# EAGLE design LEDMatrix_1_1 (EAGLE 4.16)
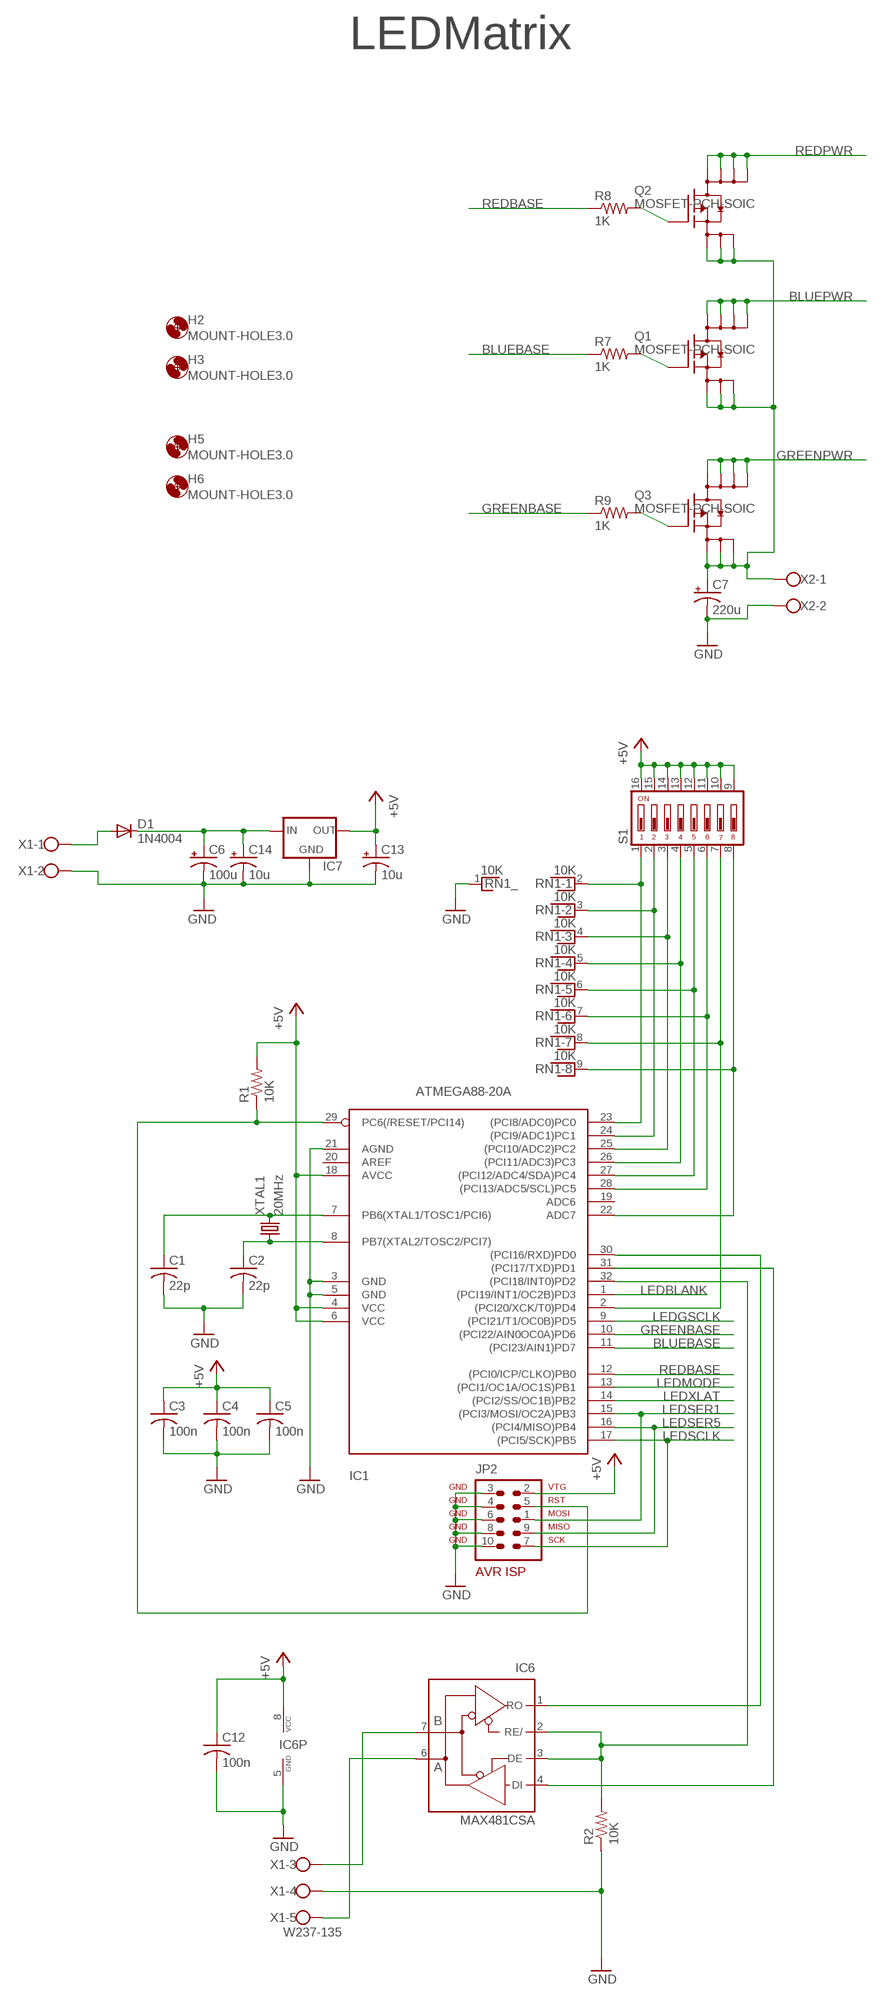
[diagram p0: schematic, sheet 1, part 1 of 2]
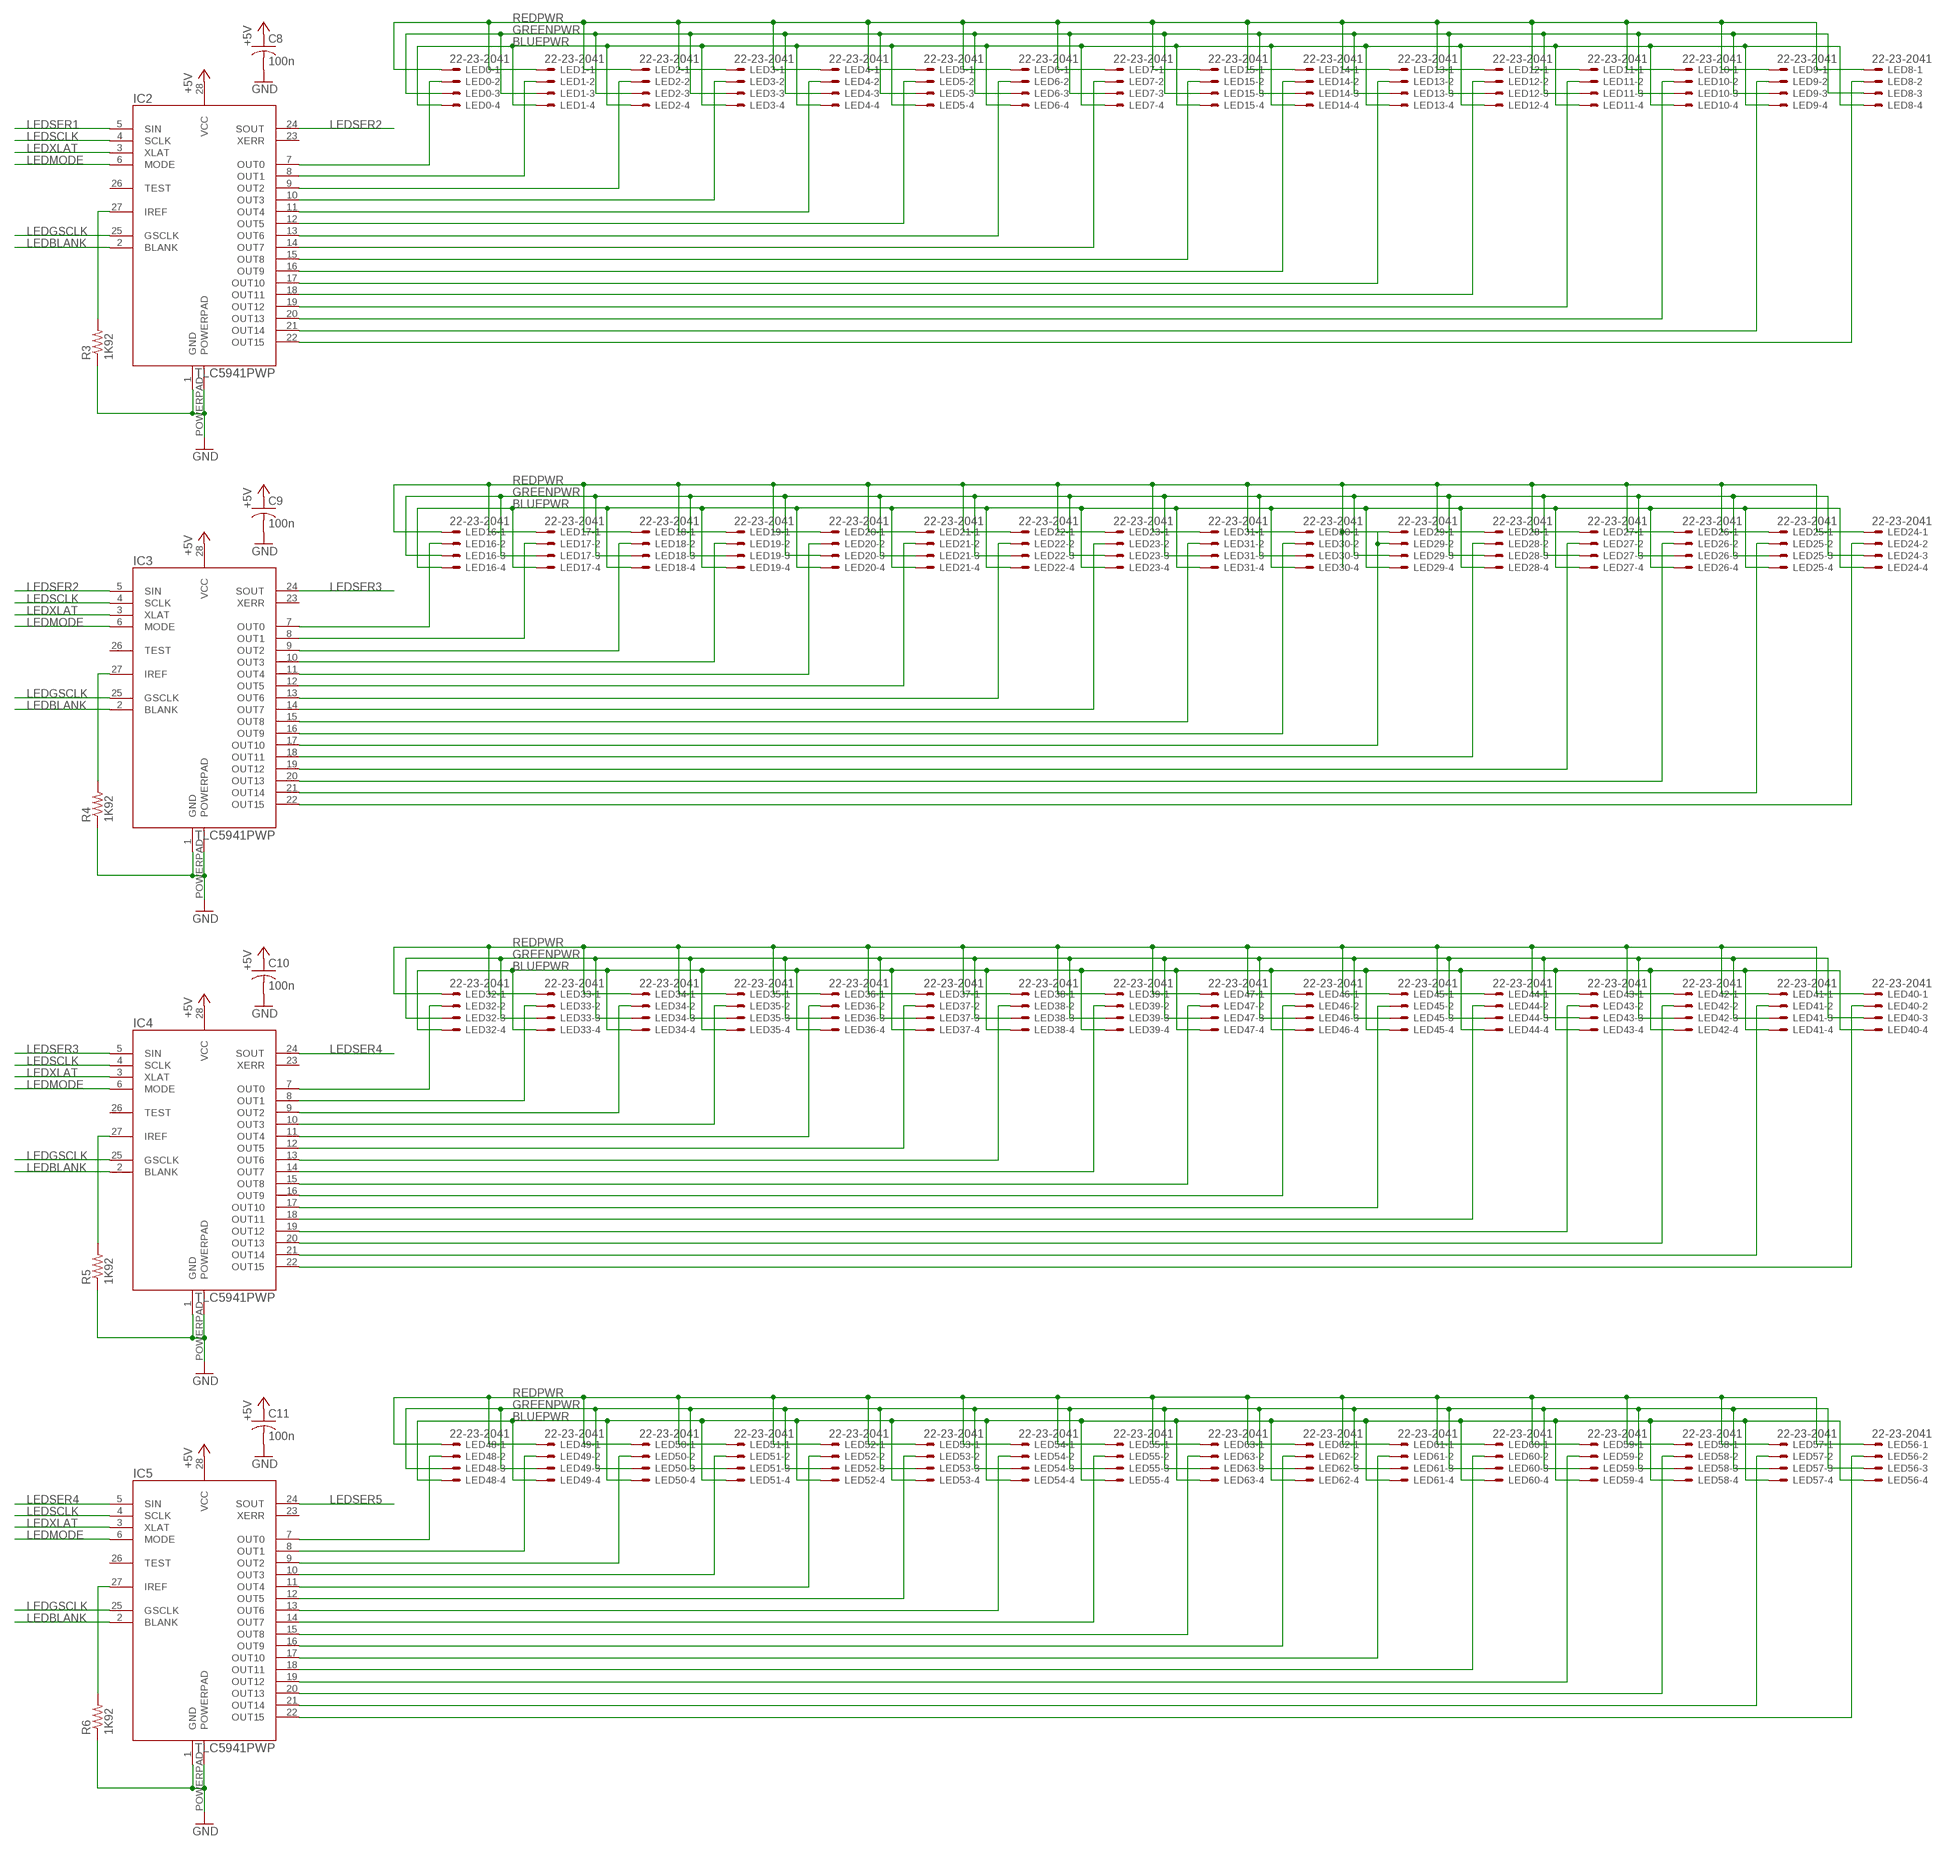
[diagram p1: schematic, sheet 1, part 2 of 2]

## Parts
C1  22p  C-USC0805  [C0805]
C2  22p  C-USC0805  [C0805]
C3  100n  C-USC0805  [C0805]
C4  100n  C-USC0805  [C0805]
C5  100n  C-USC0805  [C0805]
C6  100u  CPOL-USD  [PANASONIC_D]
C7  220u  CPOL-USE3.5-8  [E3,5-8]
C8  100n  C-USC0805  [C0805]
C9  100n  C-USC0805  [C0805]
C10  100n  C-USC0805  [C0805]
C11  100n  C-USC0805  [C0805]
C12  100n  C-USC0805  [C0805]
C13  10u  CPOL-USB  [PANASONIC_B]
C14  10u  CPOL-USB  [PANASONIC_B]
D1  1N4004  [DO41-10]
H2  MOUNT-HOLE3.0  [3,0]
H3  MOUNT-HOLE3.0  [3,0]
H5  MOUNT-HOLE3.0  [3,0]
H6  MOUNT-HOLE3.0  [3,0]
IC1  ATMEGA88-20A  ATMEGA48-20A  [TQFP32-08]
IC2  TLC5941PWP  [POWERPAD-28]
IC3  TLC5941PWP  [POWERPAD-28]
IC4  TLC5941PWP  [POWERPAD-28]
IC5  TLC5941PWP  [POWERPAD-28]
IC6  MAX481CSA  [SO08]
IC7  LM1117  [SOT223]
JP2  AVR-ISP-10ML  [ML10]
LED0  22-23-2041  [22-23-2041]
LED1  22-23-2041  [22-23-2041]
LED2  22-23-2041  [22-23-2041]
LED3  22-23-2041  [22-23-2041]
LED4  22-23-2041  [22-23-2041]
LED5  22-23-2041  [22-23-2041]
LED6  22-23-2041  [22-23-2041]
LED7  22-23-2041  [22-23-2041]
LED8  22-23-2041  [22-23-2041]
LED9  22-23-2041  [22-23-2041]
LED10  22-23-2041  [22-23-2041]
LED11  22-23-2041  [22-23-2041]
LED12  22-23-2041  [22-23-2041]
LED13  22-23-2041  [22-23-2041]
LED14  22-23-2041  [22-23-2041]
LED15  22-23-2041  [22-23-2041]
LED16  22-23-2041  [22-23-2041]
LED17  22-23-2041  [22-23-2041]
LED18  22-23-2041  [22-23-2041]
LED19  22-23-2041  [22-23-2041]
LED20  22-23-2041  [22-23-2041]
LED21  22-23-2041  [22-23-2041]
LED22  22-23-2041  [22-23-2041]
LED23  22-23-2041  [22-23-2041]
LED24  22-23-2041  [22-23-2041]
LED25  22-23-2041  [22-23-2041]
LED26  22-23-2041  [22-23-2041]
LED27  22-23-2041  [22-23-2041]
LED28  22-23-2041  [22-23-2041]
LED29  22-23-2041  [22-23-2041]
LED30  22-23-2041  [22-23-2041]
LED31  22-23-2041  [22-23-2041]
LED32  22-23-2041  [22-23-2041]
LED33  22-23-2041  [22-23-2041]
LED34  22-23-2041  [22-23-2041]
LED35  22-23-2041  [22-23-2041]
LED36  22-23-2041  [22-23-2041]
LED37  22-23-2041  [22-23-2041]
LED38  22-23-2041  [22-23-2041]
LED39  22-23-2041  [22-23-2041]
LED40  22-23-2041  [22-23-2041]
LED41  22-23-2041  [22-23-2041]
LED42  22-23-2041  [22-23-2041]
LED43  22-23-2041  [22-23-2041]
LED44  22-23-2041  [22-23-2041]
LED45  22-23-2041  [22-23-2041]
LED46  22-23-2041  [22-23-2041]
LED47  22-23-2041  [22-23-2041]
LED48  22-23-2041  [22-23-2041]
LED49  22-23-2041  [22-23-2041]
LED50  22-23-2041  [22-23-2041]
LED51  22-23-2041  [22-23-2041]
LED52  22-23-2041  [22-23-2041]
LED53  22-23-2041  [22-23-2041]
LED54  22-23-2041  [22-23-2041]
LED55  22-23-2041  [22-23-2041]
LED56  22-23-2041  [22-23-2041]
LED57  22-23-2041  [22-23-2041]
LED58  22-23-2041  [22-23-2041]
LED59  22-23-2041  [22-23-2041]
LED60  22-23-2041  [22-23-2041]
LED61  22-23-2041  [22-23-2041]
LED62  22-23-2041  [22-23-2041]
LED63  22-23-2041  [22-23-2041]
Q1  MOSFET-PCH-SOIC  [SOIC127P600X175-8AN]
Q2  MOSFET-PCH-SOIC  [SOIC127P600X175-8AN]
Q3  MOSFET-PCH-SOIC  [SOIC127P600X175-8AN]
R1  10K  R-US_M0805  [M0805]
R2  10K  R-US_M0805  [M0805]
R3  1K92  R-US_M0805  [M0805]
R4  1K92  R-US_M0805  [M0805]
R5  1K92  R-US_M0805  [M0805]
R6  1K92  R-US_M0805  [M0805]
R7  1K  R-US_M0805  [M0805]
R8  1K  R-US_M0805  [M0805]
R9  1K  R-US_M0805  [M0805]
RN1  10K  RNX9  [RN-10]
S1  DIP08YL  [DIP08YL]
X1  W237-135  [W237-135]
X2  W237-102  [W237-102]
XTAL1  20MHz  CRYSTALHC49S  [HC49/S]

## Nets
+5V: C3.1 C4.1 C5.1 C8.1 C9.1 C10.1 C11.1 C12.1 C13.+ IC1.4(VCC) IC1.6(VCC) IC1.18(AVCC) IC2.28(VCC) IC3.28(VCC) IC4.28(VCC) IC5.28(VCC) IC6.8(VCC) IC7.2(OUT) JP2.2 R1.2 S1.9 S1.10 S1.11 S1.12 S1.13 S1.14 S1.15 S1.16
BLUEBASE: IC1.11((PCI23/AIN1)PD7) R7.1
BLUEPWR: LED0.4 LED1.4 LED2.4 LED3.4 LED4.4 LED5.4 LED6.4 LED7.4 LED8.4 LED9.4 LED10.4 LED11.4 LED12.4 LED13.4 LED14.4 LED15.4 LED16.4 LED17.4 LED18.4 LED19.4 LED20.4 LED21.4 LED22.4 LED23.4 LED24.4 LED25.4 LED26.4 LED27.4 LED28.4 LED29.4 LED30.4 LED31.4 LED32.4 LED33.4 LED34.4 LED35.4 LED36.4 LED37.4 LED38.4 LED39.4 LED40.4 LED41.4 LED42.4 LED43.4 LED44.4 LED45.4 LED46.4 LED47.4 LED48.4 LED49.4 LED50.4 LED51.4 LED52.4 LED53.4 LED54.4 LED55.4 LED56.4 LED57.4 LED58.4 LED59.4 LED60.4 LED61.4 LED62.4 LED63.4 Q1.5(D) Q1.6(D1) Q1.7(D2) Q1.8(D3)
GND: C1.2 C2.2 C3.2 C4.2 C5.2 C6.- C7.- C8.2 C9.2 C10.2 C11.2 C12.2 C13.- C14.- IC1.3(GND) IC1.5(GND) IC1.21(AGND) IC2.1(GND) IC2.POWERPAD IC3.1(GND) IC3.POWERPAD IC4.1(GND) IC4.POWERPAD IC5.1(GND) IC5.POWERPAD IC6.5(GND) IC7.1(GND) JP2.3 JP2.4 JP2.6 JP2.8 JP2.10 R2.1 R3.1 R4.1 R5.1 R6.1 RN1.1 X1.2 X1.4 X2.2
GREENBASE: IC1.10((PCI22/AIN0OC0A)PD6) R9.1
GREENPWR: LED0.3 LED1.3 LED2.3 LED3.3 LED4.3 LED5.3 LED6.3 LED7.3 LED8.3 LED9.3 LED10.3 LED11.3 LED12.3 LED13.3 LED14.3 LED15.3 LED16.3 LED17.3 LED18.3 LED19.3 LED20.3 LED21.3 LED22.3 LED23.3 LED24.3 LED25.3 LED26.3 LED27.3 LED28.3 LED29.3 LED30.3 LED31.3 LED32.3 LED33.3 LED34.3 LED35.3 LED36.3 LED37.3 LED38.3 LED39.3 LED40.3 LED41.3 LED42.3 LED43.3 LED44.3 LED45.3 LED46.3 LED47.3 LED48.3 LED49.3 LED50.3 LED51.3 LED52.3 LED53.3 LED54.3 LED55.3 LED56.3 LED57.3 LED58.3 LED59.3 LED60.3 LED61.3 LED62.3 LED63.3 Q3.5(D) Q3.6(D1) Q3.7(D2) Q3.8(D3)
LEDBLANK: IC1.1((PCI19/INT1/OC2B)PD3) IC2.2(BLANK) IC3.2(BLANK) IC4.2(BLANK) IC5.2(BLANK)
LEDGSCLK: IC1.9((PCI21/T1/OC0B)PD5) IC2.25(GSCLK) IC3.25(GSCLK) IC4.25(GSCLK) IC5.25(GSCLK)
LEDMODE: IC1.13((PCI1/OC1A/OC1S)PB1) IC2.6(MODE) IC3.6(MODE) IC4.6(MODE) IC5.6(MODE)
LEDSCLK: IC1.17((PCI5/SCK)PB5) IC2.4(SCLK) IC3.4(SCLK) IC4.4(SCLK) IC5.4(SCLK) JP2.7
LEDSER1: IC1.15((PCI3/MOSI/OC2A)PB3) IC2.5(SIN) JP2.1
LEDSER2: IC2.24(SOUT) IC3.5(SIN)
LEDSER3: IC3.24(SOUT) IC4.5(SIN)
LEDSER4: IC4.24(SOUT) IC5.5(SIN)
LEDSER5: IC1.16((PCI4/MISO)PB4) IC5.24(SOUT) JP2.9
LEDXLAT: IC1.14((PCI2/SS/OC1B)PB2) IC2.3(XLAT) IC3.3(XLAT) IC4.3(XLAT) IC5.3(XLAT)
N$1: D1.A X1.1
N$2: C6.+ C14.+ D1.C IC7.3(IN)
N$33: IC2.7(OUT0) LED0.2
N$36: IC2.8(OUT1) LED1.2
N$37: IC2.9(OUT2) LED2.2
N$38: IC2.10(OUT3) LED3.2
N$39: IC2.11(OUT4) LED4.2
N$40: IC2.12(OUT5) LED5.2
N$41: IC2.13(OUT6) LED6.2
N$44: IC2.14(OUT7) LED7.2
N$45: IC2.15(OUT8) LED15.2
N$46: IC2.16(OUT9) LED14.2
N$47: IC2.17(OUT10) LED13.2
N$48: IC2.18(OUT11) LED12.2
N$49: IC2.19(OUT12) LED11.2
N$50: IC2.20(OUT13) LED10.2
N$51: IC2.21(OUT14) LED9.2
N$52: IC2.22(OUT15) LED8.2
N$89: IC3.7(OUT0) LED16.2
N$90: IC3.8(OUT1) LED17.2
N$91: IC3.9(OUT2) LED18.2
N$92: IC3.10(OUT3) LED19.2
N$93: IC3.11(OUT4) LED20.2
N$94: IC3.12(OUT5) LED21.2
N$95: IC3.13(OUT6) LED22.2
N$96: IC3.14(OUT7) LED23.2
N$97: IC3.15(OUT8) LED31.2
N$98: IC3.16(OUT9) LED30.2
N$99: IC3.17(OUT10) LED29.2
N$100: IC3.18(OUT11) LED28.2
N$101: IC3.19(OUT12) LED27.2
N$102: IC3.20(OUT13) LED26.2
N$103: IC3.21(OUT14) LED25.2
N$104: IC3.22(OUT15) LED24.2
N$141: IC4.7(OUT0) LED32.2
N$142: IC4.8(OUT1) LED33.2
N$143: IC4.9(OUT2) LED34.2
N$144: IC4.10(OUT3) LED35.2
N$145: IC4.11(OUT4) LED36.2
N$146: IC4.12(OUT5) LED37.2
N$147: IC4.13(OUT6) LED38.2
N$148: IC4.14(OUT7) LED39.2
N$149: IC4.15(OUT8) LED47.2
N$150: IC4.16(OUT9) LED46.2
N$151: IC4.17(OUT10) LED45.2
N$152: IC4.18(OUT11) LED44.2
N$153: IC4.19(OUT12) LED43.2
N$154: IC4.20(OUT13) LED42.2
N$155: IC4.21(OUT14) LED41.2
N$156: IC4.22(OUT15) LED40.2
N$193: IC5.7(OUT0) LED48.2
N$194: IC5.8(OUT1) LED49.2
N$195: IC5.9(OUT2) LED50.2
N$196: IC5.10(OUT3) LED51.2
N$197: IC5.11(OUT4) LED52.2
N$198: IC5.12(OUT5) LED53.2
N$199: IC5.13(OUT6) LED54.2
N$200: IC5.14(OUT7) LED55.2
N$201: IC5.15(OUT8) LED63.2
N$202: IC5.16(OUT9) LED62.2
N$203: IC5.17(OUT10) LED61.2
N$204: IC5.18(OUT11) LED60.2
N$205: IC5.19(OUT12) LED59.2
N$206: IC5.20(OUT13) LED58.2
N$207: IC5.21(OUT14) LED57.2
N$208: IC5.22(OUT15) LED56.2
N$211: C1.1 IC1.7(PB6(XTAL1/TOSC1/PCI6)) XTAL1.2
N$212: C2.1 IC1.8(PB7(XTAL2/TOSC2/PCI7)) XTAL1.1
N$213: IC1.23((PCI8/ADC0)PC0) RN1.2 S1.1
N$214: IC1.24((PCI9/ADC1)PC1) RN1.3 S1.2
N$215: IC1.25((PCI10/ADC2)PC2) RN1.4 S1.3
N$216: IC1.26((PCI11/ADC3)PC3) RN1.5 S1.4
N$217: IC1.27((PCI12/ADC4/SDA)PC4) RN1.6 S1.5
N$218: IC1.28((PCI13/ADC5/SCL)PC5) RN1.7 S1.6
N$219: IC1.2((PCI20/XCK/T0)PD4) RN1.8 S1.7
N$220: IC1.22(ADC7) RN1.9 S1.8
N$221: IC1.30((PCI16/RXD)PD0) IC6.1(RO)
N$222: IC1.31((PCI17/TXD)PD1) IC6.4(DI)
N$223: IC1.32((PCI18/INT0)PD2) IC6.2(RE/) IC6.3(DE) R2.2
N$224: C7.+ Q1.1(S) Q1.2(S1) Q1.3(S2) Q2.1(S) Q2.2(S1) Q2.3(S2) Q3.1(S) Q3.2(S1) Q3.3(S2) X2.1
N$225: IC1.29(PC6(/RESET/PCI14)) JP2.5 R1.1
N$229: IC6.7(B) X1.3
N$230: IC6.6(A) X1.5
N$232: Q2.4(G) R8.2
N$233: Q1.4(G) R7.2
N$234: Q3.4(G) R9.2
N$244: IC2.27(IREF) R3.2
N$245: IC3.27(IREF) R4.2
N$246: IC5.27(IREF) R6.2
N$247: IC4.27(IREF) R5.2
REDBASE: IC1.12((PCI0/ICP/CLKO)PB0) R8.1
REDPWR: LED0.1 LED1.1 LED2.1 LED3.1 LED4.1 LED5.1 LED6.1 LED7.1 LED8.1 LED9.1 LED10.1 LED11.1 LED12.1 LED13.1 LED14.1 LED15.1 LED16.1 LED17.1 LED18.1 LED19.1 LED20.1 LED21.1 LED22.1 LED23.1 LED24.1 LED25.1 LED26.1 LED27.1 LED28.1 LED29.1 LED30.1 LED31.1 LED32.1 LED33.1 LED34.1 LED35.1 LED36.1 LED37.1 LED38.1 LED39.1 LED40.1 LED41.1 LED42.1 LED43.1 LED44.1 LED45.1 LED46.1 LED47.1 LED48.1 LED49.1 LED50.1 LED51.1 LED52.1 LED53.1 LED54.1 LED55.1 LED56.1 LED57.1 LED58.1 LED59.1 LED60.1 LED61.1 LED62.1 LED63.1 Q2.5(D) Q2.6(D1) Q2.7(D2) Q2.8(D3)
Unconnected: IC1.19(ADC6) IC1.20(AREF) IC2.23(XERR) IC2.26(TEST) IC3.23(XERR) IC3.26(TEST) IC4.23(XERR) IC4.26(TEST) IC5.23(XERR) IC5.26(TEST) RN1.10

## Notes on the sheet
- LEDMatrix

## Library data of the parts
C1-C5 C8-C12 = rcl:C-US: CAPACITOR, American symbol
C6 C7 C13 C14 = rcl:CPOL-US: POLARIZED CAPACITOR, American symbol
D1 = diode:1N4004: DIODE general purpose rectifier, 1 A
H2 H3 H5 H6 = holes:MOUNT-HOLE: MOUNTING HOLE with drill center marker
IC1 = avr:ATMEGA48: MICROCONTROLLER 4 Kbytes FLASH 512 Bytes SRAM 256 Bytes EEPROM USART 8-channel 10 bit ADC
IC2-IC5 = rbg-ti-ledcontrol:TLC5941
IC6 = maxim:MAX481CSA: RS485 TRANSEIVER
IC7 = v-reg-3:LM1117
JP2 = atmel-1:AVR-ISP-10: AVR ISP-10 Serial Programming Header
LED0 LED1-LED63 = con-molex:22-23-2041: .100" (2.54mm) Center Header - 4 Pin
Q1-Q3 = ipc-7351-transistor:MOSFET-PCH-SOIC
R1-R9 = rcl:R-US_: RESISTOR, American symbol
RN1 = resistor-net:RNX9: RESISTOR NETWORK
S1 = switch-dil:DIP08YL: DIL/CODE SWITCH
X1 = rbg-generic-screwterm-5mm:W237-135
X2 = rbg-generic-screwterm-5mm:W237-102: WAGO SCREW CLAMP
XTAL1 = crystal:CRYSTAL: CRYSTAL

## Board
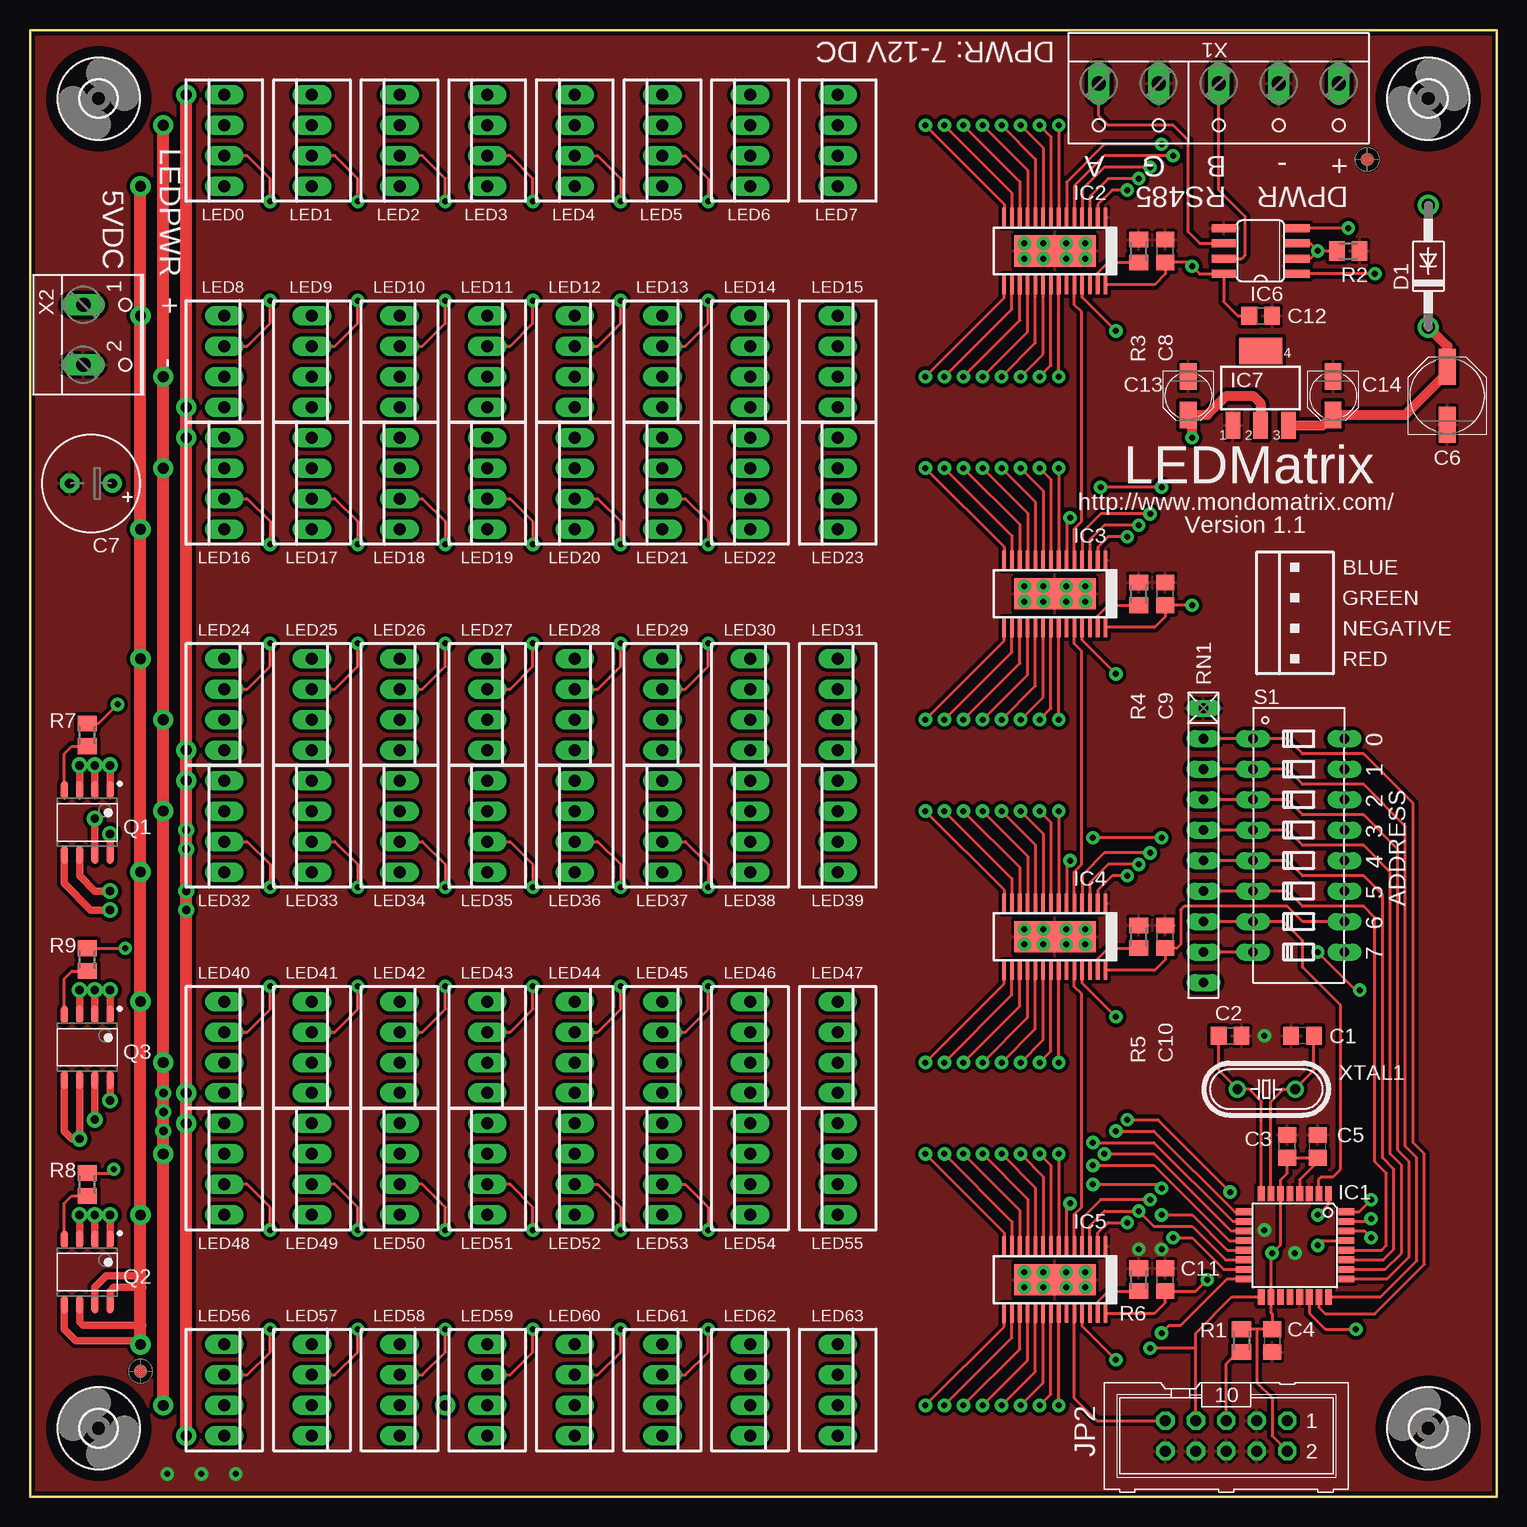
[diagram p2: board, top side]
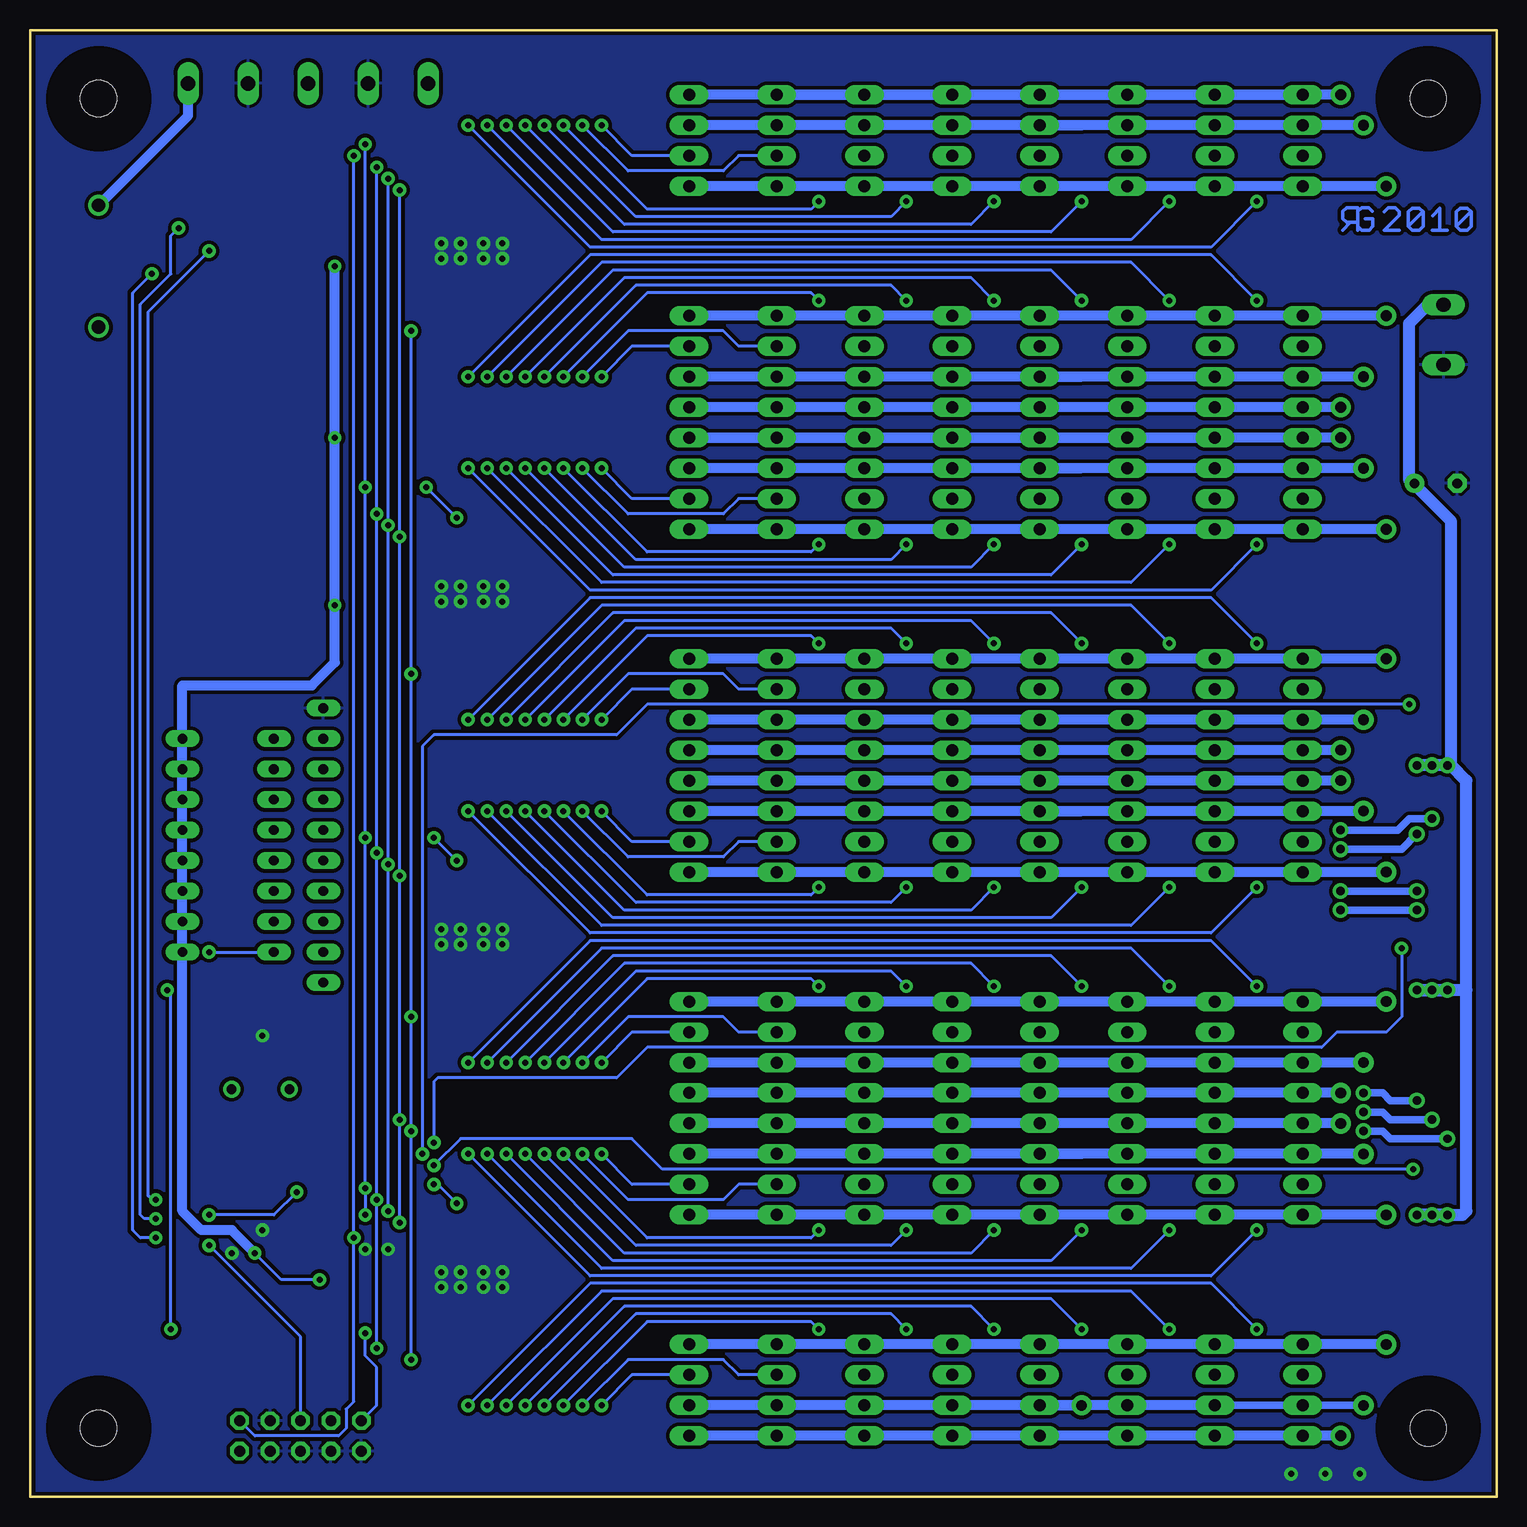
[diagram p3: board, bottom side, seen from below]

Size 122.24 x 122.24 mm. Coordinates in mm from the lower left corner, seen from the top.
Outline: 0,0 0,122.24 122.24,122.24 122.24,0 0,0
Copper layers (1*16): Top 0.035mm / dielectric 1.5mm / Bottom 0.035mm
Design rules "default": minimum track width 8mil, minimum drill 19mil, track to track 8mil, track to pad 8mil, pad to pad 8mil, via to via 8mil, smd to smd 8mil, copper to edge 10mil, drill to drill 8mil, minimum pad ring 12mil, minimum via ring 12mil, stop-mask expansion 4mil, vias tented up to drill 0mil, thermal gap 10mil

### Footprints (pad centres in the part's own frame; a part is rotated, then mirrored left to right if it is on the bottom)
C0805 = smd 1.3 x 1.5: 1 -0.95,0; 2 0.95,0
PANASONIC_D = smd 3 x 1.4: + 2.4,0; - -2.4,0
E3,5-8 = drill 0.813 pad 1.6 round: + -1.778,0 | drill 0.813 pad 1.6 octagon: - 1.778,0
PANASONIC_B = smd 2.2 x 1.4: + 1.6,0; - -1.6,0
DO41-10 = drill 1.118 round: A 5.08,0; C -5.08,0
3,0 = hole 3: 0,0
TQFP32-08 = smd 1.27 x 0.559: 1 -4.293,2.8; 2 -4.293,2; 3 -4.293,1.2; 4 -4.293,0.4; 5 -4.293,-0.4; 6 -4.293,-1.2; 7 -4.293,-2; 8 -4.293,-2.8; 17 4.293,-2.8; 18 4.293,-2; 19 4.293,-1.2; 20 4.293,-0.4; 21 4.293,0.4; 22 4.293,1.2; 23 4.293,2; 24 4.293,2.8 | smd 0.559 x 1.27: 9 -2.8,-4.293; 10 -2,-4.293; 11 -1.2,-4.293; 12 -0.4,-4.293; 13 0.4,-4.293; 14 1.2,-4.293; 15 2,-4.293; 16 2.8,-4.293; 25 2.8,4.293; 26 2,4.293; 27 1.2,4.293; 28 0.4,4.293; 29 -0.4,4.293; 30 -1.2,4.293; 31 -2,4.293; 32 -2.8,4.293
POWERPAD-28 = smd 0.3 x 1.6: 1 -4.225,-2.8; 2 -3.575,-2.8; 3 -2.925,-2.8; 4 -2.275,-2.8; 5 -1.625,-2.8; 6 -0.975,-2.8; 7 -0.325,-2.8; 8 0.325,-2.8; 9 0.975,-2.8; 10 1.625,-2.8; 11 2.275,-2.8; 12 2.925,-2.8; 13 3.575,-2.8; 14 4.225,-2.8; 15 4.225,2.8; 16 3.575,2.8; 17 2.925,2.8; 18 2.275,2.8; 19 1.625,2.8; 20 0.975,2.8; 21 0.325,2.8; 22 -0.325,2.8; 23 -0.975,2.8; 24 -1.625,2.8; 25 -2.275,2.8; 26 -2.925,2.8; 27 -3.575,2.8; 28 -4.225,2.8 | smd 6.8 x 2.6: POWERPAD 0,0
SO08 = smd 0.66 x 2.032: 1 -1.905,-3.073; 2 -0.635,-3.073; 3 0.635,-3.073; 4 1.905,-3.073; 5 1.905,3.073; 6 0.635,3.073; 7 -0.635,3.073; 8 -1.905,3.073
SOT223 = smd 1.219 x 2.235: 1 -2.311,-3.099; 2 0,-3.099; 3 2.311,-3.099 | smd 3.6 x 2.2: 4 0,3.099
ML10 = drill 0.914 octagon: 1 -5.08,-1.27; 2 -5.08,1.27; 3 -2.54,-1.27; 4 -2.54,1.27; 5 0,-1.27; 6 0,1.27; 7 2.54,-1.27; 8 2.54,1.27; 9 5.08,-1.27; 10 5.08,1.27
22-23-2041 = drill 1 long: 1 -3.81,0; 2 -1.27,0; 3 1.27,0; 4 3.81,0
SOIC127P600X175-8AN = smd 1.55 x 0.6: 1 -2.7,1.905; 2 -2.7,0.635; 3 -2.7,-0.635; 4 -2.7,-1.905; 5 2.7,-1.905; 6 2.7,-0.635; 7 2.7,0.635; 8 2.7,1.905
M0805 = smd 1.3 x 1.6: 1 -0.95,0; 2 0.95,0
RN-10 = drill 0.813 long: 1 -11.43,0; 2 -8.89,0; 3 -6.35,0; 4 -3.81,0; 5 -1.27,0; 6 1.27,0; 7 3.81,0; 8 6.35,0; 9 8.89,0; 10 11.43,0
DIP08YL = drill 0.813 long: 1 -8.89,-3.81; 2 -6.35,-3.81; 3 -3.81,-3.81; 4 -1.27,-3.81; 5 1.27,-3.81; 6 3.81,-3.81; 7 6.35,-3.81; 8 8.89,-3.81; 9 8.89,3.81; 10 6.35,3.81; 11 3.81,3.81; 12 1.27,3.81; 13 -1.27,3.81; 14 -3.81,3.81; 15 -6.35,3.81; 16 -8.89,3.81
W237-135 = drill 1.194 long: 1 -10,-1.27; 2 -5,-1.27; 3 0,-1.27; 4 5,-1.27; 5 10,-1.27
W237-102 = drill 1.194 long: 1 -2.5,-1.27; 2 2.5,-1.27
HC49/S = drill 0.813 round: 1 -2.413,0; 2 2.413,0

### Placement (x,y rotation side)
C1  106.05,38.42 180 top
C2  100.01,38.42 0 top
C3  104.78,29.21 90 top
C4  103.5,13.02 270 top
C5  107.31,29.21 90 top
C6  118.11,91.76 90 top
C7  5.08,84.45 180 top
C8  94.61,103.82 90 top
C9  94.61,75.25 90 top
C10  94.61,46.67 90 top
C11  94.61,18.1 90 top
C12  102.55,98.42 0 top
C13  96.52,91.76 270 top
C14  108.58,91.76 270 top
D1  116.52,102.55 90 top
H2  5.71,116.52 0 top
H3  116.52,116.52 0 top
H5  116.52,5.71 90 top
H6  5.71,5.71 90 top
IC1  105.41,20.95 270 top
IC2  85.41,103.82 180 top
IC3  85.41,75.25 180 top
IC4  85.41,46.67 180 top
IC5  85.41,18.1 180 top
IC6  102.55,103.82 90 top
IC7  102.55,92.39 0 top
JP2  99.69,5.08 180 top
LED0  16.19,113.03 90 top
LED1  23.5,113.03 90 top
LED2  30.8,113.03 90 top
LED3  38.1,113.03 90 top
LED4  45.4,113.03 90 top
LED5  52.7,113.03 90 top
LED6  60.01,113.03 90 top
LED7  67.31,113.03 90 top
LED8  16.19,94.61 270 top
LED9  23.5,94.61 270 top
LED10  30.8,94.61 270 top
LED11  38.1,94.61 270 top
LED12  45.4,94.61 270 top
LED13  52.7,94.61 270 top
LED14  60.01,94.61 270 top
LED15  67.31,94.61 270 top
LED16  16.19,84.45 90 top
LED17  23.5,84.45 90 top
LED18  30.8,84.45 90 top
LED19  38.1,84.45 90 top
LED20  45.4,84.45 90 top
LED21  52.7,84.45 90 top
LED22  60.01,84.45 90 top
LED23  67.31,84.45 90 top
LED24  16.19,66.04 270 top
LED25  23.5,66.04 270 top
LED26  30.8,66.04 270 top
LED27  38.1,66.04 270 top
LED28  45.4,66.04 270 top
LED29  52.7,66.04 270 top
LED30  60.01,66.04 270 top
LED31  67.31,66.04 270 top
LED32  16.19,55.88 90 top
LED33  23.5,55.88 90 top
LED34  30.8,55.88 90 top
LED35  38.1,55.88 90 top
LED36  45.4,55.88 90 top
LED37  52.7,55.88 90 top
LED38  60.01,55.88 90 top
LED39  67.31,55.88 90 top
LED40  16.19,37.47 270 top
LED41  23.5,37.47 270 top
LED42  30.8,37.47 270 top
LED43  38.1,37.47 270 top
LED44  45.4,37.47 270 top
LED45  52.7,37.47 270 top
LED46  60.01,37.47 270 top
LED47  67.31,37.47 270 top
LED48  16.19,27.3 90 top
LED49  23.5,27.3 90 top
LED50  30.8,27.3 90 top
LED51  38.1,27.3 90 top
LED52  45.4,27.3 90 top
LED53  52.7,27.3 90 top
LED54  60.01,27.3 90 top
LED55  67.31,27.3 90 top
LED56  16.19,8.89 270 top
LED57  23.5,8.89 270 top
LED58  30.8,8.89 270 top
LED59  38.1,8.89 270 top
LED60  45.4,8.89 270 top
LED61  52.7,8.89 270 top
LED62  60.01,8.89 270 top
LED63  67.31,8.89 270 top
Q1  4.76,56.2 270 top
Q2  4.76,18.73 270 top
Q3  4.76,37.47 270 top
R1  100.97,13.02 90 top
R2  109.86,103.82 180 top
R3  92.39,103.82 270 top
R4  92.39,75.25 270 top
R5  92.39,46.67 270 top
R6  92.39,18.1 270 top
R7  4.76,63.5 270 top
R8  4.76,26.04 270 top
R9  4.76,44.77 270 top
RN1  97.79,54.29 270 top
S1  105.73,54.29 270 top
U$1  [RGLOGO_SMALL_2010]  11.43,105.41 0 bottom
U$2  [LED-LEGEND]  102.87,68.58 0 top
U$3  [FIDUCIAL_G10]  9.21,10.48 0 top
U$4  [FIDUCIAL_G10]  111.44,111.44 180 top
X1  99.06,116.52 180 top
X2  5.71,96.84 270 top
XTAL1  103.03,33.97 0 top

### Tracks (layer width: path | path; a pad name or v marks a point on that pad's centre or on a via)
+5V  (via drill 0.5)
  Top 0.254: IC2.28 93.72,101.02 94.61,101.92 C8.1 96.52,102.87 v96.84,102.55 97.47,101.92 IC6.8 99.48,99.59 100.65,98.42 C12.1 | IC3.28 93.72,72.45 94.61,73.34 C9.1 v96.83,74.3 v96.84,74.3 | IC4.28 93.72,43.87 94.61,44.77 C10.1 95.57,45.72 95.89,46.04 95.89,48.9 96.2,49.21 104.78,49.21 106.05,47.94 S1.10 | IC5.28 93.72,15.3 94.61,16.19 C11.1 97.16,17.15 v98.11,18.1 | R1.2 102.23,13.97 | 102.23,13.97 C4.1 103.5,15.24 103.41,15.34 IC1.18 103.41,20.23 v103.5,20.32 104.21,21.02 104.21,21.27 IC1.6 104.21,26.42 104.78,26.99 C3.1 | JP2.2 103.5,5.08 103.5,8.26 102.23,9.53 102.23,13.97 | 102.23,13.97 | C5.1 107.31,27.94 105.81,26.43 IC1.4 | C3.1 | C5.1 | C3.1 C5.1
  Top 0.813: C13.+ 96.84,89.85 v96.84,88.27 | IC7.2 102.55,91.12 101.92,91.76 99.69,91.76 98.11,90.17 C13.+ | C13.+
  Bottom 0.254: v98.11,18.1 101.28,18.1 v103.5,20.32
  Bottom 0.813: v103.5,20.32 105.41,22.23 107.95,22.23 109.54,23.81 S1.9 S1.10 S1.11 S1.12 S1.13 S1.14 S1.15 S1.16 109.54,67.63 98.74,67.63 96.84,69.53 v96.84,74.3 v96.84,88.27 v96.84,102.55
BLUEBASE  (via drill 0.5)
  Top 0.254: R7.1 5.71,64.45 v7.3,66.04 | v89.53,28.57 93.66,28.57 100.08,22.16 IC1.11
  Bottom 0.254: v7.3,66.04 70.8,66.04 73.34,63.5 88.58,63.5 89.53,62.55 v89.53,28.57
BLUEPWR  (via drill 0.7 pad 1.27, 0.9 pad 1.68)
  Top 0.61: v6.67,55.24 Q1.8 | v5.4,56.52 Q1.7 | Q1.6 4.13,51.75 5.4,50.48 v6.67,50.48 | Q1.5 2.86,51.12 5.08,48.9 v6.67,48.9
  Top 1.016: v13.02,5.08 v13.02,31.11 v13.02,33.66 v13.02,48.9 v13.02,50.48 v13.02,53.98 v13.02,55.56 v13.02,59.69 v13.02,62.23 v13.02,88.27 v13.02,90.81 v13.02,116.84
  Bottom 0.61: v13.02,53.98 7.94,53.98 v6.67,55.24 | v5.4,56.52 7.3,56.52 8.26,55.56 v13.02,55.56 | v13.02,50.48 v6.67,50.48 | v13.02,48.9 v6.67,48.9
  Bottom 0.813: LED6.4 LED7.4 | LED6.4 LED5.4 LED4.4 LED3.4 LED2.4 LED1.4 LED0.4 | LED15.4 60.64,90.81 60.33,91.12 LED14.4 LED13.4 LED12.4 LED11.4 LED10.4 LED9.4 LED8.4 v13.02,90.81 | LED17.4 LED18.4 LED19.4 LED20.4 LED21.4 LED22.4 LED23.4 LED16.4 v13.02,88.27 | v13.02,116.84 LED6.4 | v13.02,5.08 LED56.4 LED57.4 LED58.4 LED59.4 LED60.4 LED61.4 LED62.4 LED63.4 | v13.02,31.11 LED48.4 LED49.4 LED50.4 LED51.4 LED52.4 LED53.4 LED54.4 LED55.4 | v13.02,33.66 LED40.4 LED41.4 LED42.4 LED43.4 LED44.4 LED45.4 LED46.4 LED47.4 | v13.02,59.69 LED32.4 LED33.4 LED34.4 LED35.4 LED36.4 LED37.4 LED38.4 LED39.4 | v13.02,62.23 LED24.4 LED25.4 LED26.4 LED27.4 LED28.4 LED29.4 LED30.4 LED31.4
GND  (via drill 0.5)
  other vias: 102.87,22.23 105.41,20.32 102.87,38.42 92.39,20.64 94.3,20.64 82.87,18.73 84.45,18.73 82.87,17.46 84.45,17.46 86.36,17.46 86.36,18.73 87.95,18.73 87.95,17.46 82.87,47.31 82.87,46.04 84.45,46.04 84.45,47.31 86.36,47.31 86.36,46.04 87.95,46.04 87.95,47.31 87.95,75.88 87.95,74.61 86.36,74.61 86.36,75.88 84.45,75.88 84.45,74.61 82.87,74.61 82.87,75.88 82.87,104.46 82.87,103.19 84.45,103.19 84.45,104.46 86.36,104.46 86.36,103.19 87.95,103.19 87.95,104.46 11.43,1.91 14.29,1.91 17.14,1.91
  pour Top (isolate 0.305): -1.59,123.83 124.78,123.83 124.78,-0.95 -1.59,-0.95
  pour Bottom (isolate 0.305): -1.59,123.83 124.78,123.83 124.78,-0.95 -1.59,-0.95
GREENBASE  (via drill 0.5)
  Top 0.254: R9.1 v7.93,45.72 v7.94,45.72 | v88.58,29.53 93.66,29.53 100.23,22.95 IC1.10
  Bottom 0.254: v88.58,29.53 88.58,34.61 88.27,34.92 73.34,34.92 70.8,37.47 14.61,37.47 13.34,38.73 9.21,38.73 7.94,40.01 v7.94,45.72
GREENPWR  (via drill 0.7 pad 1.27, 0.9 pad 1.68)
  Top 0.61: v6.67,33.02 Q3.8 | v5.4,31.43 Q3.7 | Q3.6 v4.13,29.84 3.49,29.84 2.86,30.48 Q3.5
  Top 1.016: v11.11,7.62 v11.11,28.57 v11.11,30.48 v11.11,32.07 v11.11,33.66 v11.11,36.2 v11.11,57.15 v11.11,64.77 v11.11,85.72 v11.11,93.34 v11.11,114.3
  Bottom 0.61: v11.11,7.62 LED56.3 LED57.3 | v11.11,33.66 9.53,33.66 8.89,33.02 v6.67,33.02 | v11.11,32.07 9.53,32.07 8.89,31.43 v5.4,31.43 | v4.13,29.84 8.89,29.84 9.53,30.48 v11.11,30.48
  Bottom 0.813: LED57.3 LED58.3 LED59.3 v34.61,7.62 LED60.3 LED61.3 | LED61.3 53.02,7.62 | LED61.3 LED62.3 LED63.3 | LED55.3 LED54.3 LED53.3 LED52.3 LED51.3 | LED51.3 37.78,28.57 | LED51.3 34.61,28.57 | LED51.3 LED50.3 LED49.3 LED48.3 v11.11,28.57 | LED47.3 LED46.3 LED45.3 LED44.3 LED43.3 LED42.3 LED41.3 LED40.3 v11.11,36.2 | LED38.3 59.69,57.15 | LED38.3 LED39.3 | LED38.3 LED37.3 LED36.3 LED35.3 | LED35.3 34.61,57.15 | LED35.3 LED34.3 LED33.3 LED32.3 v11.11,57.15 | LED31.3 LED30.3 LED29.3 LED28.3 LED27.3 LED26.3 LED25.3 LED24.3 v11.11,64.77 | LED19.3 34.61,85.72 | LED19.3 LED18.3 LED17.3 LED16.3 v11.11,85.72 | LED15.3 LED14.3 LED13.3 LED12.3 LED11.3 | LED11.3 34.61,93.34 | LED11.3 LED10.3 LED9.3 LED8.3 v11.11,93.34 | LED7.3 LED6.3 LED5.3 | LED5.3 52.39,114.3 | LED5.3 LED4.3 LED3.3 | LED3.3 34.61,114.3 | LED3.3 LED2.3 LED1.3 LED0.3 v11.11,114.3 | LED19.3 LED20.3 LED21.3 LED22.3 LED23.3
LEDBLANK  (via drill 0.5)
  Top 0.254: IC2.2 88.98,107.72 90.17,108.9 v91.44,108.9 | IC5.2 88.98,21.99 89.85,22.86 v91.44,22.86 | IC4.2 88.98,50.56 90.17,51.75 v91.44,51.75 | IC3.2 88.98,79.14 89.85,80.01 v91.44,80.01 | IC1.1 108.21,24.39 v107.31,23.5 | v91.44,31.43 93.98,31.43 v100.01,25.4
  Bottom 0.254: v91.44,22.86 v91.44,31.43 v91.44,51.75 v91.44,80.01 v91.44,108.9 | v107.31,23.5 101.92,23.5 v100.01,25.4
LEDGSCLK  (via drill 0.5)
  Top 0.254: IC2.25 87.68,99.96 v90.49,97.16 | IC5.25 87.68,14.23 v90.49,11.43 | IC4.25 87.68,42.81 v90.49,40.01 | IC3.25 87.68,71.39 v90.49,68.58 | IC1.9 100.39,23.75 93.66,30.48 v90.49,30.48
  Bottom 0.254: v90.49,11.43 v90.49,30.48 v90.49,40.01 v90.49,68.58 v90.49,97.16
LEDMODE  (via drill 0.5)
  Top 0.254: IC2.6 86.38,109.56 89.53,112.71 v94.3,112.71 | v88.58,26.04 93.98,26.04 v94.3,25.72 | IC5.6 86.38,24.15 v86.68,24.45 | 86.38,81.28 IC3.6 | 86.38,81.28 86.38,81.3 | v94.3,84.14 v89.22,84.14 | IC4.6 86.38,52.73 v86.68,53.02 | v94.3,54.93 v88.58,54.93 | 86.38,81.28 86.36,81.28 v86.68,81.6 | IC1.13 99.78,20.55 96.84,23.5 v94.3,23.5
  Bottom 0.254: v94.3,112.71 v94.3,84.14 v94.3,54.93 v94.3,25.72 v94.3,23.5 | v86.68,24.45 88.27,26.04 v88.58,26.04 | v88.58,54.93 v86.68,53.02 | v89.22,84.14 v86.68,81.6
LEDSCLK  (via drill 0.5)
  Top 0.254: IC5.4 87.68,23.23 89.22,24.77 v93.34,24.77 | IC2.4 87.68,108.95 89.53,110.81 v93.34,110.81 | IC3.4 87.68,80.38 89.22,81.92 v93.34,81.92 | IC4.4 87.68,51.8 89.53,53.66 v93.34,53.66 | IC1.17 100.17,16.66 97.16,13.65 97.16,12.38 | JP2.7 97.16,12.38 | 97.16,12.38 v93.34,12.38
  Bottom 0.254: v93.34,110.81 v93.34,81.92 v93.34,53.66 v93.34,24.77 v93.34,12.38
LEDSER1  (via drill 0.5)
  Top 0.254: IC2.5 87.03,109.26 89.53,111.76 v95.25,111.76 | IC1.15 99.47,18.95 96.84,21.59 v95.25,21.59
  Bottom 0.254: v95.25,111.76 v95.25,21.59 95.25,7.94 95.89,7.3 95.89,5.71 96.52,5.08 103.5,5.08 JP2.1
LEDSER2
  Top 0.254: IC3.5 87.03,80.68 87.63,81.28 87.63,98.74 87.03,99.34 IC2.24
LEDSER3
  Top 0.254: IC4.5 87.03,52.11 87.63,52.7 87.63,70.48 87.03,71.08 IC3.24
LEDSER4
  Top 0.254: IC5.5 87.03,23.53 87.63,24.13 87.63,41.91 87.03,42.51 IC4.24
LEDSER5  (via drill 0.5)
  Top 0.254: IC5.24 87.03,8.22 88.9,6.35 JP2.9 | IC1.16 99.75,18.16 95.89,14.29 94.93,14.29 v94.3,13.65
  Bottom 0.254: v94.3,13.65 94.3,11.75 93.34,10.79 93.34,7.62 JP2.9
LEDXLAT  (via drill 0.5)
  Top 0.254: IC2.3 88.33,108.33 89.85,109.86 v92.39,109.86 | IC5.3 88.33,22.61 89.53,23.81 v92.39,23.81 93.66,22.54 96.84,22.54 99.62,19.75 IC1.14 | IC3.3 88.33,79.76 89.53,80.96 v92.39,80.96 | IC4.3 88.33,51.19 89.85,52.7 v92.39,52.7
  Bottom 0.254: v92.39,23.81 v92.39,52.7 v92.39,80.96 v92.39,109.86
N$1
  Bottom 0.813: X1.1 109.06,115.09 D1.A
N$2
  Top 0.813: D1.C 118.11,95.89 C6.+ 118.11,93.66 114.61,90.16 C14.+ 107.71,89.29 IC7.3
N$33  (via drill 0.5)
  Top 0.254: IC2.7 85.73,114.29 v85.72,114.3 | LED0.2 18.1,111.76 20,109.86 v20,107.95
  Bottom 0.254: v85.72,114.3 75.56,104.14 23.81,104.14 v20,107.95
N$36  (via drill 0.5)
  Top 0.254: IC2.8 85.08,113.36 v84.14,114.3 | LED1.2 25.4,111.76 27.3,109.86 v27.3,107.95
  Bottom 0.254: v84.14,114.3 74.61,104.78 30.48,104.78 v27.3,107.95
N$37  (via drill 0.5)
  Top 0.254: IC2.9 84.43,112.42 v82.55,114.3 | LED2.2 32.7,111.76 34.61,109.86 v34.61,107.95
  Bottom 0.254: v82.55,114.3 73.66,105.41 37.15,105.41 v34.61,107.95
N$38  (via drill 0.5)
  Top 0.254: IC2.10 83.78,111.48 v80.96,114.3 | LED3.2 40.01,111.76 41.91,109.86 v41.91,107.95
  Bottom 0.254: v80.96,114.3 72.71,106.05 43.81,106.05 v41.91,107.95
N$39  (via drill 0.5)
  Top 0.254: IC2.11 83.13,110.54 v79.38,114.3 | LED4.2 47.31,111.76 49.21,109.86 v49.21,107.95
  Bottom 0.254: v79.38,114.3 71.75,106.68 50.48,106.68 v49.21,107.95
N$40  (via drill 0.5)
  Top 0.254: IC2.12 82.48,109.61 v77.79,114.3 | LED5.2 54.61,111.76 56.52,109.86 v56.52,107.95
  Bottom 0.254: v77.79,114.3 70.8,107.31 57.15,107.31 v56.52,107.95
N$41  (via drill 0.5)
  Top 0.254: IC2.13 81.83,108.67 v76.2,114.3
  Bottom 0.254: v76.2,114.3 72.39,110.49 64.45,110.49 63.18,111.76 LED6.2
N$44  (via drill 0.5)
  Top 0.254: IC2.14 81.18,107.73 v74.61,114.3
  Bottom 0.254: v74.61,114.3 72.07,111.76 LED7.2
N$45  (via drill 0.5)
  Top 0.254: IC2.15 81.18,99.92 v74.61,93.34
  Bottom 0.254: v74.61,93.34 72.07,95.89 LED15.2
N$46  (via drill 0.5)
  Top 0.254: IC2.16 81.83,98.98 v76.2,93.34
  Bottom 0.254: v76.2,93.34 72.39,97.16 64.45,97.16 63.18,95.89 LED14.2
N$47  (via drill 0.5)
  Top 0.254: IC2.17 82.48,98.04 v77.79,93.34 | LED13.2 54.61,95.89 56.52,97.79 v56.52,99.69
  Bottom 0.254: v77.79,93.34 70.8,100.33 57.15,100.33 v56.52,99.69
N$48  (via drill 0.5)
  Top 0.254: IC2.18 83.13,97.1 v79.38,93.34 | LED12.2 47.31,95.89 49.21,97.79 v49.21,99.69
  Bottom 0.254: v79.38,93.34 71.75,100.97 50.48,100.97 v49.21,99.69
N$49  (via drill 0.5)
  Top 0.254: IC2.19 83.78,96.17 v80.96,93.34 | LED11.2 40.01,95.89 41.91,97.79 v41.91,99.69
  Bottom 0.254: v80.96,93.34 72.71,101.6 43.81,101.6 v41.91,99.69
N$50  (via drill 0.5)
  Top 0.254: IC2.20 84.43,95.23 v82.55,93.34 | LED10.2 32.7,95.89 34.61,97.79 v34.61,99.69
  Bottom 0.254: v82.55,93.34 73.66,102.23 37.15,102.23 v34.61,99.69
N$51  (via drill 0.5)
  Top 0.254: IC2.21 85.08,94.29 v84.14,93.34 | LED9.2 25.4,95.89 27.3,97.79 v27.3,99.69
  Bottom 0.254: v84.14,93.34 74.61,102.87 30.48,102.87 v27.3,99.69
N$52  (via drill 0.5)
  Top 0.254: IC2.22 85.73,93.35 v85.72,93.34 | LED8.2 18.1,95.89 20,97.79 v20,99.69
  Bottom 0.254: v85.72,93.34 75.56,103.5 23.81,103.5 v20,99.69
N$89  (via drill 0.5)
  Top 0.254: IC3.7 85.73,85.72 v85.72,85.72 | LED16.2 18.1,83.19 20,81.28 v20,79.38
  Bottom 0.254: v85.72,85.72 75.56,75.56 23.81,75.56 v20,79.38
N$90  (via drill 0.5)
  Top 0.254: IC3.8 85.08,84.78 v84.14,85.72 | LED17.2 25.4,83.19 27.3,81.28 v27.3,79.38
  Bottom 0.254: v84.14,85.72 74.61,76.2 30.48,76.2 v27.3,79.38
N$91  (via drill 0.5)
  Top 0.254: IC3.9 84.43,83.84 v82.55,85.72 | LED18.2 32.7,83.19 34.61,81.28 v34.61,79.38
  Bottom 0.254: v82.55,85.72 73.66,76.83 37.15,76.83 v34.61,79.38
N$92  (via drill 0.5)
  Top 0.254: IC3.10 83.78,82.91 v80.96,85.72 | LED19.2 40.01,83.19 41.91,81.28 v41.91,79.38
  Bottom 0.254: v80.96,85.72 72.71,77.47 43.81,77.47 v41.91,79.38
N$93  (via drill 0.5)
  Top 0.254: IC3.11 83.13,81.97 v79.38,85.72 | LED20.2 47.31,83.19 49.21,81.28 v49.21,79.38
  Bottom 0.254: v79.38,85.72 71.75,78.11 50.48,78.11 v49.21,79.38
N$94  (via drill 0.5)
  Top 0.254: IC3.12 82.48,81.03 v77.79,85.72 | LED21.2 54.61,83.19 56.52,81.28 v56.52,79.38
  Bottom 0.254: v77.79,85.72 70.8,78.74 57.15,78.74 v56.52,79.38
N$95  (via drill 0.5)
  Top 0.254: IC3.13 81.83,80.09 v76.2,85.72
  Bottom 0.254: v76.2,85.72 72.39,81.92 64.45,81.92 63.18,83.19 LED22.2
N$96  (via drill 0.5)
  Top 0.254: IC3.14 81.18,79.16 v74.61,85.72
  Bottom 0.254: v74.61,85.72 72.07,83.19 LED23.2
N$97  (via drill 0.5)
  Top 0.254: IC3.15 81.18,71.34 v74.61,64.77
  Bottom 0.254: v74.61,64.77 72.07,67.31 LED31.2
N$98  (via drill 0.5)
  Top 0.254: IC3.16 81.83,70.4 v76.2,64.77
  Bottom 0.254: v76.2,64.77 72.39,68.58 64.45,68.58 63.18,67.31 LED30.2
N$99  (via drill 0.5)
  Top 0.254: IC3.17 82.48,69.47 v77.79,64.77 | LED29.2 54.61,67.31 56.52,69.22 v56.52,71.12
  Bottom 0.254: v77.79,64.77 70.8,71.75 57.15,71.75 v56.52,71.12
N$100  (via drill 0.5)
  Top 0.254: IC3.18 83.13,68.53 v79.38,64.77 | LED28.2 47.31,67.31 49.21,69.22 v49.21,71.12
  Bottom 0.254: v79.38,64.77 71.75,72.39 50.48,72.39 v49.21,71.12
N$101  (via drill 0.5)
  Top 0.254: IC3.19 83.78,67.59 v80.96,64.77 | LED27.2 40.01,67.31 41.91,69.22 v41.91,71.12
  Bottom 0.254: v80.96,64.77 72.71,73.03 43.81,73.03 v41.91,71.12
N$102  (via drill 0.5)
  Top 0.254: IC3.20 84.43,66.65 v82.55,64.77 | LED26.2 32.7,67.31 34.61,69.22 v34.61,71.12
  Bottom 0.254: v82.55,64.77 73.66,73.66 37.15,73.66 v34.61,71.12
N$103  (via drill 0.5)
  Top 0.254: IC3.21 85.08,65.72 v84.14,64.77 | LED25.2 25.4,67.31 27.3,69.22 v27.3,71.12
  Bottom 0.254: v84.14,64.77 74.61,74.3 30.48,74.3 v27.3,71.12
N$104  (via drill 0.5)
  Top 0.254: IC3.22 85.73,64.78 v85.72,64.77 | LED24.2 18.1,67.31 20,69.22 v20,71.12
  Bottom 0.254: v20,71.12 23.81,74.93 75.56,74.93 v85.72,64.77
N$141  (via drill 0.5)
  Top 0.254: IC4.7 85.73,57.14 v85.72,57.15 | LED32.2 18.1,54.61 20,52.7 v20,50.8
  Bottom 0.254: v85.72,57.15 75.56,46.99 23.81,46.99 v20,50.8
N$142  (via drill 0.5)
  Top 0.254: IC4.8 85.08,56.2 v84.14,57.15 | LED33.2 25.4,54.61 27.3,52.7 v27.3,50.8
  Bottom 0.254: v84.14,57.15 74.61,47.62 30.48,47.62 v27.3,50.8
N$143  (via drill 0.5)
  Top 0.254: IC4.9 84.43,55.27 v82.55,57.15 | LED34.2 32.7,54.61 34.61,52.7 v34.61,50.8
  Bottom 0.254: v82.55,57.15 73.66,48.26 37.15,48.26 v34.61,50.8
N$144  (via drill 0.5)
  Top 0.254: IC4.10 83.78,54.33 v80.96,57.15 | LED35.2 40.01,54.61 41.91,52.7 v41.91,50.8
  Bottom 0.254: v80.96,57.15 72.71,48.9 43.81,48.9 v41.91,50.8
N$145  (via drill 0.5)
  Top 0.254: IC4.11 83.13,53.39 v79.38,57.15 | LED36.2 47.31,54.61 49.21,52.7 v49.21,50.8
  Bottom 0.254: v79.38,57.15 71.75,49.53 50.48,49.53 v49.21,50.8
N$146  (via drill 0.5)
  Top 0.254: IC4.12 82.48,52.45 v77.79,57.15 | LED37.2 54.61,54.61 56.52,52.7 v56.52,50.8
  Bottom 0.254: v77.79,57.15 70.8,50.16 57.15,50.16 v56.52,50.8
N$147  (via drill 0.5)
  Top 0.254: IC4.13 81.83,51.52 v76.2,57.15
  Bottom 0.254: v76.2,57.15 72.39,53.34 64.45,53.34 63.18,54.61 LED38.2
N$148  (via drill 0.5)
  Top 0.254: IC4.14 81.18,50.58 v74.61,57.15
  Bottom 0.254: v74.61,57.15 72.07,54.61 LED39.2
N$149  (via drill 0.5)
  Top 0.254: IC4.15 81.18,42.77 v74.61,36.2
  Bottom 0.254: v74.61,36.2 72.07,38.73 LED47.2
N$150  (via drill 0.5)
  Top 0.254: IC4.16 81.83,41.83 v76.2,36.2
  Bottom 0.254: v76.2,36.2 72.39,40.01 64.45,40.01 63.18,38.73 LED46.2
N$151  (via drill 0.5)
  Top 0.254: IC4.17 82.48,40.89 v77.79,36.2 | LED45.2 54.61,38.73 56.52,40.64 v56.52,42.55
  Bottom 0.254: v77.79,36.2 70.8,43.18 57.15,43.18 v56.52,42.55
N$152  (via drill 0.5)
  Top 0.254: IC4.18 83.13,39.95 v79.38,36.2 | LED44.2 47.31,38.73 49.21,40.64 v49.21,42.55
  Bottom 0.254: v79.38,36.2 71.75,43.81 50.48,43.81 v49.21,42.55
N$153  (via drill 0.5)
  Top 0.254: IC4.19 83.78,39.02 v80.96,36.2 | LED43.2 40.01,38.73 41.91,40.64 v41.91,42.55
  Bottom 0.254: v80.96,36.2 72.71,44.45 43.81,44.45 v41.91,42.55
N$154  (via drill 0.5)
  Top 0.254: IC4.20 84.43,38.08 v82.55,36.2 | LED42.2 32.7,38.73 34.61,40.64 v34.61,42.55
  Bottom 0.254: v34.61,42.55 37.15,45.09 73.66,45.09 v82.55,36.2
N$155  (via drill 0.5)
  Top 0.254: IC4.21 85.08,37.14 v84.14,36.2 | LED41.2 25.4,38.73 27.3,40.64 v27.3,42.55
  Bottom 0.254: v84.14,36.2 74.61,45.72 30.48,45.72 v27.3,42.55
N$156  (via drill 0.5)
  Top 0.254: IC4.22 85.73,43.82 85.72,43.81 v85.72,36.2 | LED40.2 18.1,38.73 20,40.64 v20,42.55
  Bottom 0.254: v20,42.55 23.81,46.35 75.56,46.35 v85.72,36.2
N$193  (via drill 0.5)
  Top 0.254: IC5.7 85.73,28.57 v85.72,28.57 | LED48.2 18.1,26.04 20,24.13 v20,22.23
  Bottom 0.254: v85.72,28.57 75.56,18.41 23.81,18.41 v20,22.23
N$194  (via drill 0.5)
  Top 0.254: IC5.8 85.08,27.63 v84.14,28.57 | LED49.2 25.4,26.04 27.3,24.13 v27.3,22.23
  Bottom 0.254: v84.14,28.57 74.61,19.05 30.48,19.05 v27.3,22.23
N$195  (via drill 0.5)
  Top 0.254: IC5.9 84.43,26.69 v82.55,28.57 | LED50.2 32.7,26.04 34.61,24.13 v34.61,22.23
  Bottom 0.254: v82.55,28.57 73.66,19.68 37.15,19.68 v34.61,22.23
N$196  (via drill 0.5)
  Top 0.254: IC5.10 83.78,25.75 v80.96,28.57 | LED51.2 40.01,26.04 41.91,24.13 v41.91,22.23
  Bottom 0.254: v80.96,28.57 72.71,20.32 43.81,20.32 v41.91,22.23
N$197  (via drill 0.5)
  Top 0.254: IC5.11 83.13,24.82 v79.38,28.57 | LED52.2 47.31,26.04 49.21,24.13 v49.21,22.23
  Bottom 0.254: v79.38,28.57 71.75,20.95 50.48,20.95 v49.21,22.23
N$198  (via drill 0.5)
  Top 0.254: IC5.12 82.48,23.88 v77.79,28.57 | LED53.2 54.61,26.04 56.52,24.13 v56.52,22.23
  Bottom 0.254: v77.79,28.57 70.8,21.59 57.15,21.59 v56.52,22.23
N$199  (via drill 0.5)
  Top 0.254: IC5.13 81.83,22.94 v76.2,28.57
  Bottom 0.254: v76.2,28.57 72.39,24.77 64.45,24.77 63.18,26.04 LED54.2
N$200  (via drill 0.5)
  Top 0.254: IC5.14 81.18,22 v74.61,28.57
  Bottom 0.254: v74.61,28.57 72.07,26.04 LED55.2
N$201  (via drill 0.5)
  Top 0.254: IC5.15 81.18,14.19 v74.61,7.62
  Bottom 0.254: v74.61,7.62 72.07,10.16 LED63.2
N$202  (via drill 0.5)
  Top 0.254: IC5.16 81.83,13.25 v76.2,7.62
  Bottom 0.254: v76.2,7.62 72.39,11.43 64.45,11.43 63.18,10.16 LED62.2
N$203  (via drill 0.5)
  Top 0.254: IC5.17 82.48,12.31 v77.79,7.62 | LED61.2 54.61,10.16 56.52,12.06 v56.52,13.97
  Bottom 0.254: v77.79,7.62 70.8,14.61 57.15,14.61 v56.52,13.97
N$204  (via drill 0.5)
  Top 0.254: IC5.18 83.13,11.38 v79.38,7.62 | LED60.2 47.31,10.16 49.21,12.06 v49.21,13.97
  Bottom 0.254: v79.38,7.62 71.75,15.24 50.48,15.24 v49.21,13.97
N$205  (via drill 0.5)
  Top 0.254: IC5.19 83.78,10.44 v80.96,7.62 | LED59.2 40.01,10.16 41.91,12.06 v41.91,13.97
  Bottom 0.254: v80.96,7.62 72.71,15.88 43.81,15.88 v41.91,13.97
N$206  (via drill 0.5)
  Top 0.254: IC5.20 84.43,9.5 v82.55,7.62 | LED58.2 32.7,10.16 34.61,12.06 v34.61,13.97
  Bottom 0.254: v82.55,7.62 73.66,16.51 37.15,16.51 v34.61,13.97
N$207  (via drill 0.5)
  Top 0.254: IC5.21 85.08,8.56 v84.14,7.62 | LED57.2 25.4,10.16 27.3,12.06 v27.3,13.97
  Bottom 0.254: v27.3,13.97 30.48,17.14 74.61,17.14 v84.14,7.62
N$208  (via drill 0.5)
  Top 0.254: IC5.22 85.73,7.63 v85.72,7.62 | LED56.2 18.1,10.16 20,12.06 v20,13.97
  Bottom 0.254: v20,13.97 23.81,17.78 75.56,17.78 v85.72,7.62
N$211
  Top 0.254: IC1.7 103.41,32.92 104.46,33.97 105.41,33.97 | 105.41,33.97 XTAL1.2 | C1.1 107,35.56 105.41,33.97
N$212
  Top 0.254: IC1.8 102.61,32.96 101.6,33.97 100.65,33.97 | 100.65,33.97 XTAL1.1 | C2.1 99.06,35.56 100.65,33.97
N$213
  Top 0.254: RN1.2 S1.1 104.78,63.18 106.05,61.91 111.12,61.91 115.25,57.78 115.25,29.53 116.2,28.57 116.2,19.37 112.08,15.24 107.95,15.24 107.41,15.78 IC1.23
N$214
  Top 0.254: RN1.3 S1.2 104.78,60.64 106.05,59.37 111.12,59.37 114.62,55.88 114.62,29.21 115.57,28.26 115.57,19.68 112.55,16.66 IC1.24
N$215
  Top 0.254: IC1.25 113.09,18.16 114.94,20 114.94,27.94 113.98,28.89 113.98,53.98 111.12,56.83 106.05,56.83 104.78,58.1 S1.3 RN1.4
N$216
  Top 0.254: IC1.26 112.94,18.95 114.3,20.32 114.3,27.62 113.35,28.57 113.35,52.07 111.12,54.29 106.05,54.29 104.78,55.56 S1.4 RN1.5
N$217
  Top 0.254: IC1.27 112.78,19.75 113.67,20.64 113.67,27.3 112.71,28.26 112.71,50.16 111.12,51.75 106.05,51.75 104.78,53.02 S1.5 RN1.6
N$218
  Top 0.254: IC1.28 112.63,20.55 113.03,20.95 113.03,26.99 112.08,27.94 112.08,48.26 111.12,49.21 106.05,49.21 104.78,50.48 S1.6 RN1.7
N$219
  Top 0.254: RN1.8 S1.7 104.46,47.94 106.05,46.35 106.05,44.13 109.22,40.96 109.22,27.3 108.58,26.67 107.63,26.67 107.41,26.45 IC1.2
N$220  (via drill 0.5)
  Top 0.254: S1.8 RN1.9 | IC1.22 106.61,15.31 107.95,13.97 v110.49,13.97 | v110.81,42.23 110.49,42.23 v107.31,45.4
  Bottom 0.254: v110.49,13.97 110.49,41.91 v110.81,42.23 | v107.31,45.4 S1.8
N$221  (via drill 0.5)
  Top 0.254: v112.08,101.92 IC6.1 | IC1.30 111.19,22.16 v111.76,21.59
  Bottom 0.254: v112.08,101.92 113.67,100.33 113.67,22.23 113.03,21.59 v111.76,21.59
N$222  (via drill 0.5)
  Top 0.254: v109.86,105.73 IC6.4 | IC1.31 111.54,22.95 v111.76,23.18
  Bottom 0.254: v111.76,23.18 112.71,23.18 113.03,23.5 113.03,99.38 110.49,101.92 110.49,105.09 v109.86,105.73
N$223  (via drill 0.5)
  Top 0.254: IC1.32 110.75,23.75 v111.76,24.77 | v107.31,103.82 R2.2 | IC6.3 106.68,104.46 v107.31,103.82 | IC6.2 106.68,103.19 v107.31,103.82
  Bottom 0.254: v111.76,24.77 112.08,24.77 112.39,25.08 112.39,98.74 v107.31,103.82
N$224  (via drill 0.7 pad 1.02)
  Top 0.61: v4.13,60.96 Q1.3 | v5.4,60.96 Q1.2 | v6.67,60.96 Q1.1 | v4.13,42.23 Q3.3 | v5.4,42.23 Q3.2 | v6.67,42.23 Q3.1 | Q2.3 v4.13,23.5 | v5.4,23.5 Q2.2 | v6.67,23.5 Q2.1
  Bottom 1.016: v4.13,60.96 v5.4,60.96 v6.67,60.96 v4.13,60.96 | v4.13,42.23 v5.4,42.23 v6.67,42.23 2.54,42.23 | v6.67,23.5 v5.4,23.5 v4.13,23.5 2.86,23.5 2.54,23.81 2.54,42.23 | v4.13,60.96 3.81,61.28 3.81,81.28 6.86,84.33 C7.+ 6.99,84.45 7.3,84.77 7.3,97.79 5.75,99.34 X2.1 | v4.13,60.96 3.81,60.96 2.54,59.69 2.54,42.23
N$225  (via drill 0.5)
  Top 0.254: R1.1 100.65,12.07 99.69,11.11 JP2.5 | IC1.29 107.72,21.36 v107.31,20.95
  Bottom 0.254: v107.31,20.95 99.69,13.34 JP2.5
N$229
  Top 0.254: IC6.7 100.97,103.19 101.28,103.5 101.28,106.68 99.06,108.9 X1.3
N$230
  Top 0.254: IC6.6 97.47,104.46 96.52,105.41 96.52,113.03 95.25,114.3 89.85,114.3 89.06,115.09 X1.5
N$232
  Top 0.254: Q2.4 2.86,24.45 3.49,25.08 4.45,25.08 4.45,25.09 R8.2
N$233
  Top 0.254: Q1.4 2.86,61.91 3.49,62.55 4.45,62.55 R7.2
N$234
  Top 0.254: Q3.4 2.86,43.18 3.49,43.81 R9.2
N$244
  Top 0.254: R3.2 89.86,102.87 88.98,102 IC2.27
N$245
  Top 0.254: IC3.27 88.98,73.42 89.85,74.3 R4.2
N$246
  Top 0.254: IC5.27 88.98,16.27 89.85,17.14 R6.2
N$247
  Top 0.254: IC4.27 88.98,44.85 89.85,45.72 R5.2
REDBASE  (via drill 0.5)
  Top 0.254: R8.1 6.67,26.98 v6.99,27.3 | IC1.12 99.93,21.36 93.66,27.62 v88.58,27.62
  Bottom 0.254: v6.99,27.3 69.53,27.3 72.07,29.84 86.36,29.84 v88.58,27.62
REDPWR  (via drill 0.9 pad 1.68)
  Top 0.61: Q2.8 6.67,17.14 6.99,17.46 9.21,17.46 | Q2.7 5.4,17.46 6.35,18.41 9.21,18.41 | Q2.6 4.13,14.61 4.45,14.29 9.21,14.29 | Q2.5 2.86,13.97 3.81,13.02 9.21,13.02
  Top 1.016: v9.21,12.7 9.21,13.02 9.21,14.29 9.21,17.46 9.21,18.41 v9.21,23.5 v9.21,41.27 v9.21,52.07 v9.21,69.85 v9.21,80.64 v9.21,98.42 v9.21,109.22
  Bottom 0.813: LED7.1 LED6.1 LED5.1 LED4.1 | LED4.1 45.09,109.22 | LED3.1 37.78,109.22 | LED3.1 LED4.1 | LED3.1 LED2.1 LED1.1 LED0.1 v9.21,109.22 | LED15.1 LED14.1 LED13.1 LED12.1 LED11.1 | LED11.1 37.78,98.42 | LED11.1 LED10.1 LED9.1 LED8.1 v9.21,98.42 | LED23.1 LED22.1 LED21.1 LED20.1 LED19.1 LED18.1 LED17.1 LED16.1 v9.21,80.64 | v9.21,12.7 LED56.1 LED57.1 LED58.1 LED59.1 LED60.1 LED61.1 LED62.1 LED63.1 | LED55.1 LED54.1 LED53.1 LED52.1 LED51.1 LED50.1 LED49.1 LED48.1 v9.21,23.5 | v9.21,69.85 LED24.1 LED25.1 LED26.1 LED27.1 LED28.1 LED29.1 LED30.1 LED31.1 | LED39.1 LED38.1 LED37.1 LED36.1 LED35.1 LED34.1 LED33.1 LED32.1 v9.21,52.07 | v9.21,41.27 LED40.1 LED41.1 LED42.1 LED43.1 LED44.1 LED45.1 LED46.1 LED47.1

### Text on the board
tPlace: LEDMatrix
tNames: DPWR: 7-12V DC | LEDPWR | A | G | B | - | + | 5VDC | RS485 | DPWR | + | - | http://www.mondomatrix.com/ | Version 1.1 | 0 | 1 | 2 | 3 | 4 | 5 | ADDRESS | 6 | 7
_tsilk: DPWR: 7-12V DC | X1 | LEDPWR | A | G | B | - | + | 5VDC | RS485 | DPWR | IC2 | LED0 | LED1 | LED2 | LED3 | LED4 | LED5 | LED6 | LED7 | R2 | X2 | 1 | IC6 | 10K | D1 | 1N4004 | + | LED8 | LED9 | LED10 | LED11 | LED12 | LED13 | LED14 | LED15 | C12 | 100n | 1K92 | 100n | 2 | - | R3 | C8 | 4 | C13 | 10u | IC7 | C14 | 10u | 1 | 2 | 3 | C6 | LEDMatrix | 100u | http://www.mondomatrix.com/ | Version 1.1 | C7 | IC3 | LED16 | LED17 | LED18 | LED19 | LED20 | LED21 | LED22 | LED23 | 220u | BLUE | GREEN | LED24 | LED25 | LED26 | LED27 | LED28 | LED29 | LED30 | LED31 | NEGATIVE | 10K | 1K92 | 100n | RED | RN1 | S1 | R7 | R4 | C9 | 1K | 0 | 1 | 2 | Q1 | 3 | 4 | IC4 | 5 | LED32 | LED33 | LED34 | LED35 | LED36 | LED37 | LED38 | LED39 | ADDRESS | R9 | 6 | 1K | 7 | LED40 | LED41 | LED42 | LED43 | LED44 | LED45 | LED46 | LED47 | 1K92 | 100n | C2 | 22p | C1 | 22p | Q3 | R5 | C10 | XTAL1 | 20MHz | C3 | C5 | 100n | R8 | 100n | 1K | IC1 | IC5 | LED48 | LED49 | LED50 | LED51 | LED52 | LED53 | LED54 | LED55 | Q2 | C11 | 100n | LED56 | LED57 | LED58 | LED59 | LED60 | LED61 | LED62 | LED63 | R6 | R1 | 1K92 | 10K | C4 | 100n | 10 | JP2 | 1 | 2